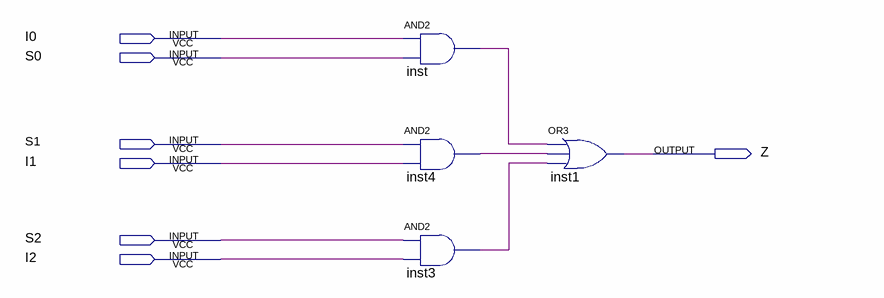
[diagram p0: schematic sheet]
// Quartus schematic mux_3x1.bdf as structural Verilog: 4 symbols, 7 pins
module mux_3x1 (
  input  I0,
  input  S0,
  input  S1,
  input  I1,
  input  S2,
  input  I2,
  output Z
);

  wire inst3_out, inst4_out, inst_out;

  and inst (inst_out, I0, S0);
  and inst4 (inst4_out, S1, I1);
  and inst3 (inst3_out, S2, I2);
  or inst1 (Z, inst_out, inst4_out, inst3_out);
endmodule
